# Altium schematic sheet DriverModule.SchDoc
size A
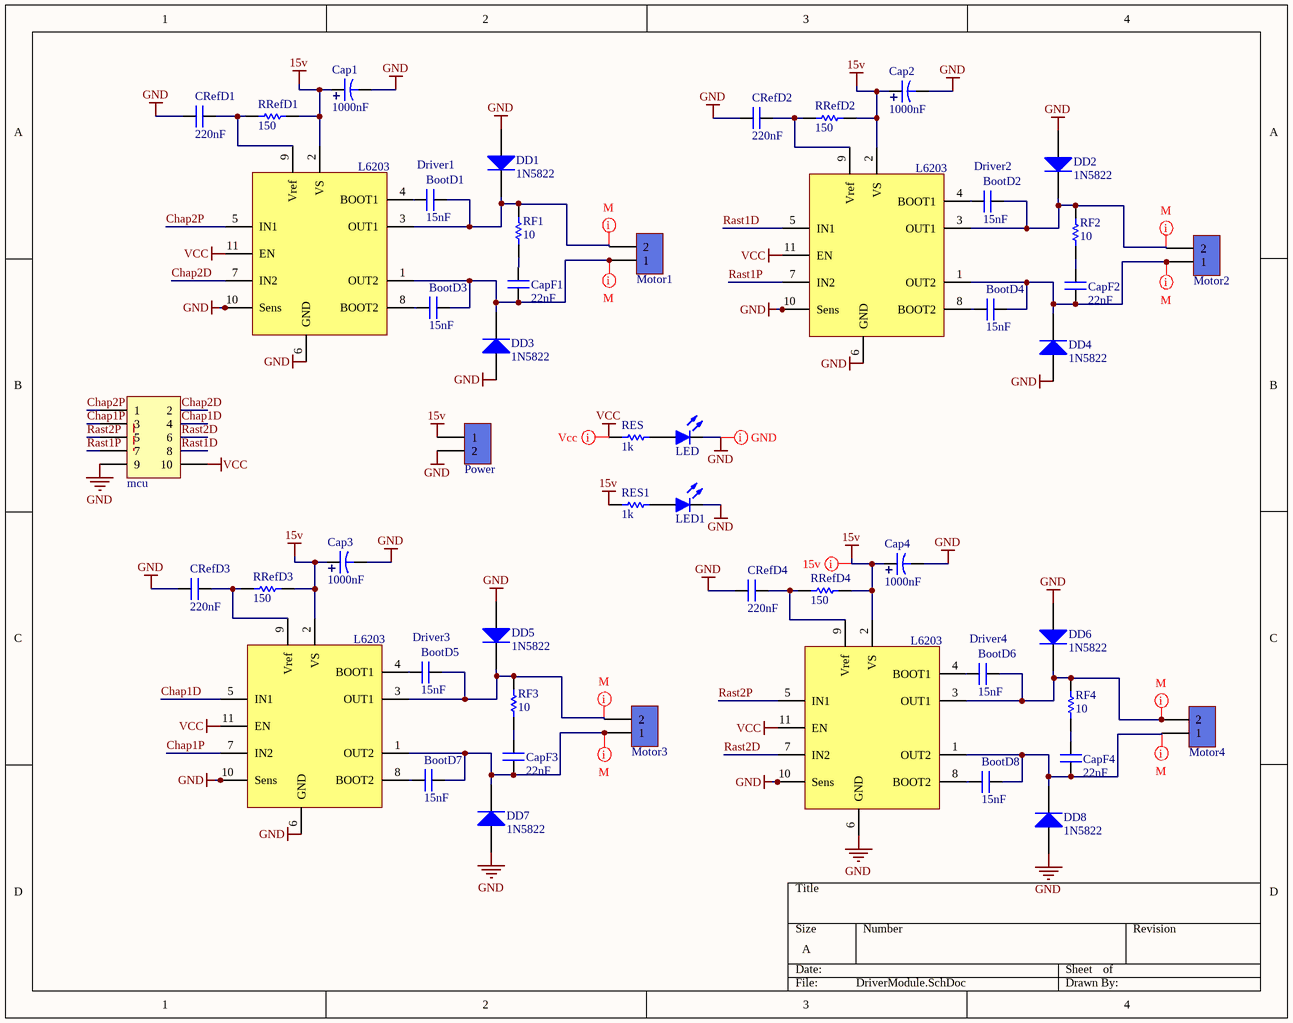
[diagram p0: DriverModule.SchDoc]

## Parts
BootD1  15nF  [Cap - 100nF]
BootD2  15nF  [Cap - 100nF]
BootD3  15nF  [Cap - 100nF]
BootD4  15nF  [Cap - 100nF]
BootD5  15nF  [Cap - 100nF]
BootD6  15nF  [Cap - 100nF]
BootD7  15nF  [Cap - 100nF]
BootD8  15nF  [Cap - 100nF]
Cap1  1000nF  [C2200UF-10V_10*16]
Cap2  1000nF  [C2200UF-10V_10*16]
Cap3  1000nF  [C2200UF-10V_10*16]
Cap4  1000nF  [C2200UF-10V_10*16]
CapF1  22nF  [Cap - 100nF]
CapF2  22nF  [Cap - 100nF]
CapF3  22nF  [Cap - 100nF]
CapF4  22nF  [Cap - 100nF]
CRefD1  220nF  [Cap - 100nF]
CRefD2  220nF  [Cap - 100nF]
CRefD3  220nF  [Cap - 100nF]
CRefD4  220nF  [Cap - 100nF]
DD1  1N5822  [Diode]
DD2  1N5822  [Diode]
DD3  1N5822  [Diode]
DD4  1N5822  [Diode]
DD5  1N5822  [Diode]
DD6  1N5822  [Diode]
DD7  1N5822  [Diode]
DD8  1N5822  [Diode]
Driver1  L6203  [L6203]
Driver2  L6203  [L6203]
Driver3  L6203  [L6203]
Driver4  L6203  [L6203]
LED  LED-SMD  [0805 LED]  (value not drawn)
LED1  LED-SMD  [0805 LED]  (value not drawn)
mcu  CONNECTOR_IDC_5X2  [IDC2.54-10PIN]  (value not drawn)
Motor1  KF301_Terminal  [KF301 2PIN]  (value not drawn)
Motor2  KF301_Terminal  [KF301 2PIN]  (value not drawn)
Motor3  KF301_Terminal  [KF301 2PIN]  (value not drawn)
Motor4  KF301_Terminal  [KF301 2PIN]  (value not drawn)
Power  KF301_Terminal  [KF301 2PIN]  (value not drawn)
RES  1k  [1206]
RES1  1k  [1206]
RF1  10  [Res-(1/4)]
RF2  10  [Res-(1/4)]
RF3  10  [Res-(1/4)]
RF4  10  [Res-(1/4)]
RRefD1  150  [Res-(1/4)]
RRefD2  150  [Res-(1/4)]
RRefD3  150  [Res-(1/4)]
RRefD4  150  [Res-(1/4)]

## Nets
15v: Cap1.1 Cap2.1 Cap3.1 Cap4.1 Driver1.2(VS) Driver2.2(VS) Driver3.2(VS) Driver4.2(VS) Power.1 RES1.1 RRefD1.2 RRefD2.2 RRefD3.2 RRefD4.2
GND: Cap1.2(-) Cap2.2(-) Cap3.2(-) Cap4.2(-) CRefD1.2(-) CRefD2.2(-) CRefD3.2(-) CRefD4.2(-) DD1.1(A) DD2.1(A) DD3.1(A) DD4.1(A) DD5.1(A) DD6.1(A) DD7.1(A) DD8.1(A) Driver1.6(GND) Driver1.10(Sens) Driver2.6(GND) Driver2.10(Sens) Driver3.6(GND) Driver3.10(Sens) Driver4.6(GND) Driver4.10(Sens) LED.2 LED1.2 mcu.9 Power.2
VCC: Driver1.11(EN) Driver2.11(EN) Driver3.11(EN) Driver4.11(EN) mcu.10 RES.1
Chap1D: Driver3.5(IN1) mcu.4
Chap1P: Driver3.7(IN2) mcu.3
Chap2D: Driver1.7(IN2) mcu.2
Chap2P: Driver1.5(IN1) mcu.1
Rast1D: Driver2.5(IN1) mcu.8
Rast1P: Driver2.7(IN2) mcu.7
Rast2D: Driver4.7(IN2) mcu.6
Rast2P: Driver4.5(IN1) mcu.5
NetBootD1_1: BootD1.1 DD1.2(K) Driver1.3(OUT1) Motor1.2 RF1.2
NetBootD1_2: BootD1.2(-) Driver1.4(BOOT1)
NetBootD2_1: BootD2.1 DD2.2(K) Driver2.3(OUT1) Motor2.2 RF2.2
NetBootD2_2: BootD2.2(-) Driver2.4(BOOT1)
NetBootD3_1: BootD3.1 Driver1.8(BOOT2)
NetBootD3_2: BootD3.2(-) CapF1.1 DD3.2(K) Driver1.1(OUT2) Motor1.1
NetBootD4_1: BootD4.1 Driver2.8(BOOT2)
NetBootD4_2: BootD4.2(-) CapF2.1 DD4.2(K) Driver2.1(OUT2) Motor2.1
NetBootD5_1: BootD5.1 DD5.2(K) Driver3.3(OUT1) Motor3.2 RF3.2
NetBootD5_2: BootD5.2(-) Driver3.4(BOOT1)
NetBootD6_1: BootD6.1 DD6.2(K) Driver4.3(OUT1) Motor4.2 RF4.2
NetBootD6_2: BootD6.2(-) Driver4.4(BOOT1)
NetBootD7_1: BootD7.1 Driver3.8(BOOT2)
NetBootD7_2: BootD7.2(-) CapF3.1 DD7.2(K) Driver3.1(OUT2) Motor3.1
NetBootD8_1: BootD8.1 Driver4.8(BOOT2)
NetBootD8_2: BootD8.2(-) CapF4.1 DD8.2(K) Driver4.1(OUT2) Motor4.1
NetCapF1_2: CapF1.2(-) RF1.1
NetCapF2_2: CapF2.2(-) RF2.1
NetCapF3_2: CapF3.2(-) RF3.1
NetCapF4_2: CapF4.2(-) RF4.1
NetCRefD1_1: CRefD1.1 Driver1.9(Vref) RRefD1.1
NetCRefD2_1: CRefD2.1 Driver2.9(Vref) RRefD2.1
NetCRefD3_1: CRefD3.1 Driver3.9(Vref) RRefD3.1
NetCRefD4_1: CRefD4.1 Driver4.9(Vref) RRefD4.1
NetLED1_1: LED1.1 RES1.2
NetLED_1: LED.1 RES.2

## Layout directives
rule Width Constraint [Pref Width = 3mm    Min Width = 1mm    Max Width = 4mm]: GND
rule Width Constraint [Pref Width = 2mm    Min Width = 1mm    Max Width = 3mm]: VCC
rule Width Constraint [Pref Width = 3mm    Min Width = 2mm    Max Width = 4mm]: 15v
rule Width Constraint [Pref Width = 1.5mm    Min Width = 1.5mm    Max Width = 3mm]: (no net found under the mark), NetBootD1_1, NetBootD2_1, NetBootD3_2, NetBootD4_2, NetBootD5_1, NetBootD6_1, NetBootD8_2

## Library data of the parts
BootD1-BootD8 CapF1-CapF4 CRefD1-CRefD4 = CAPACITOR-SMD
Cap1-Cap4 = CAPACITOR
DD1-DD8 = Diode 1N4148: High Conductance Fast Diode; Published: 8-Jun-2000; LatestRevisionDate: 17-Jul-2002; LatestRevisionNote: Re-released for DXP Platform.; DatasheetVersion: 1997; PackageReference: DO-35; Publisher: Altium Limited; PackageDescription: Diode, Axial; Body 3.8 x 1.9 mm (LxDia. max), Lead Dia. 0.53 mm (max); Code_JEDEC: DO-204-AH; ComponentLink1Description: Manufacturer Link; ComponentLink1URL: http://www.fairchildsemi.com/; ComponentLink2Description: Datasheet; ComponentLink2URL: http://www.fairchildsemi.com/ds/1N%2F1N4148.pdf
Driver1-Driver4 = L6203: DMOS FULL BRIDGE DRIVER; Designer: Saeid Jorablo; Company: ControTEK; Adding Date: 1387/01/08
mcu = IDC 5X2: IDC, 5-Pin, Dual row; Manufacturer: CHINA; designer: ABBAS BASEREH; Connector type: IDC5X2  PROGPIN; Max Current: mA; LatestRevisionDate: 1395-11-17; Publisher: ABBAS BASEREH; Mounting Technology: Through-Hole; Category: Connector; Pin Count: 10; Status: Unreleased; ComponentLink1Description: Datasheet; ComponentLink2Description: Reference; Update: 2017-2-4
Motor1-Motor4 Power = KF301-2Pin_Terminal: Terminal 2 Pin 250VAC 16A; Part. No: KF301 2P; Designer: Abbas Basereh; Link: https://www.aliexpress.com/item/
RES RES1 RF1-RF4 RRefD1-RRefD4 = RESISTOR